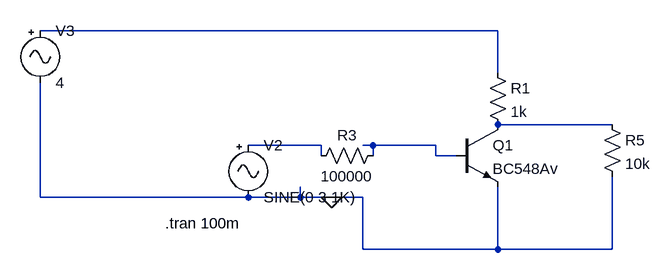
[diagram p0: schematic BC548.asc]
BC548.asc, the LTspice schematic file:
Version 4
SHEET 1 880 680
WIRE 416 0 -288 0
WIRE 416 64 416 0
WIRE 592 144 416 144
WIRE 144 176 32 176
WIRE 224 176 208 176
WIRE 320 176 224 176
WIRE 144 192 144 176
WIRE 224 192 224 176
WIRE 320 192 320 176
WIRE 352 192 320 192
WIRE -288 256 -288 80
WIRE 32 256 -288 256
WIRE 112 256 112 240
WIRE 112 256 32 256
WIRE 160 256 112 256
WIRE 208 256 160 256
WIRE 208 336 208 256
WIRE 416 336 416 240
WIRE 416 336 208 336
WIRE 592 336 592 224
WIRE 592 336 416 336
FLAG 160 256 0
SYMBOL npn 352 144 R0
SYMATTR InstName Q1
SYMATTR Value BC548Av
SYMBOL res 400 48 R0
SYMATTR InstName R1
SYMATTR Value 1k
SYMBOL Misc\\signal 32 160 R0
WINDOW 123 0 0 Left 2
WINDOW 39 0 0 Left 2
SYMATTR InstName V2
SYMATTR Value SINE(0 3 1K)
SYMBOL Misc\\signal -288 -16 R0
WINDOW 123 0 0 Left 2
WINDOW 39 0 0 Left 2
SYMATTR InstName V3
SYMATTR Value 4
SYMBOL res 576 128 R0
SYMATTR InstName R5
SYMATTR Value 10k
SYMBOL res 240 176 R90
WINDOW 0 0 56 VBottom 2
WINDOW 3 32 56 VTop 2
SYMATTR InstName R3
SYMATTR Value 100000
TEXT -96 296 Left 2 !.tran 100m

The netlist it stands for:
* BC548.asc
Q1 N002 N004 0 0 BC548Av
R1 N001 N002 1k
V2 N003 0 SINE(0 3 1K)
V3 N001 0 4
R5 N002 0 10k
R3 N004 N003 100000
.model NPN NPN
.model PNP PNP
.lib standard.bjt
.tran 100m
.backanno
.end